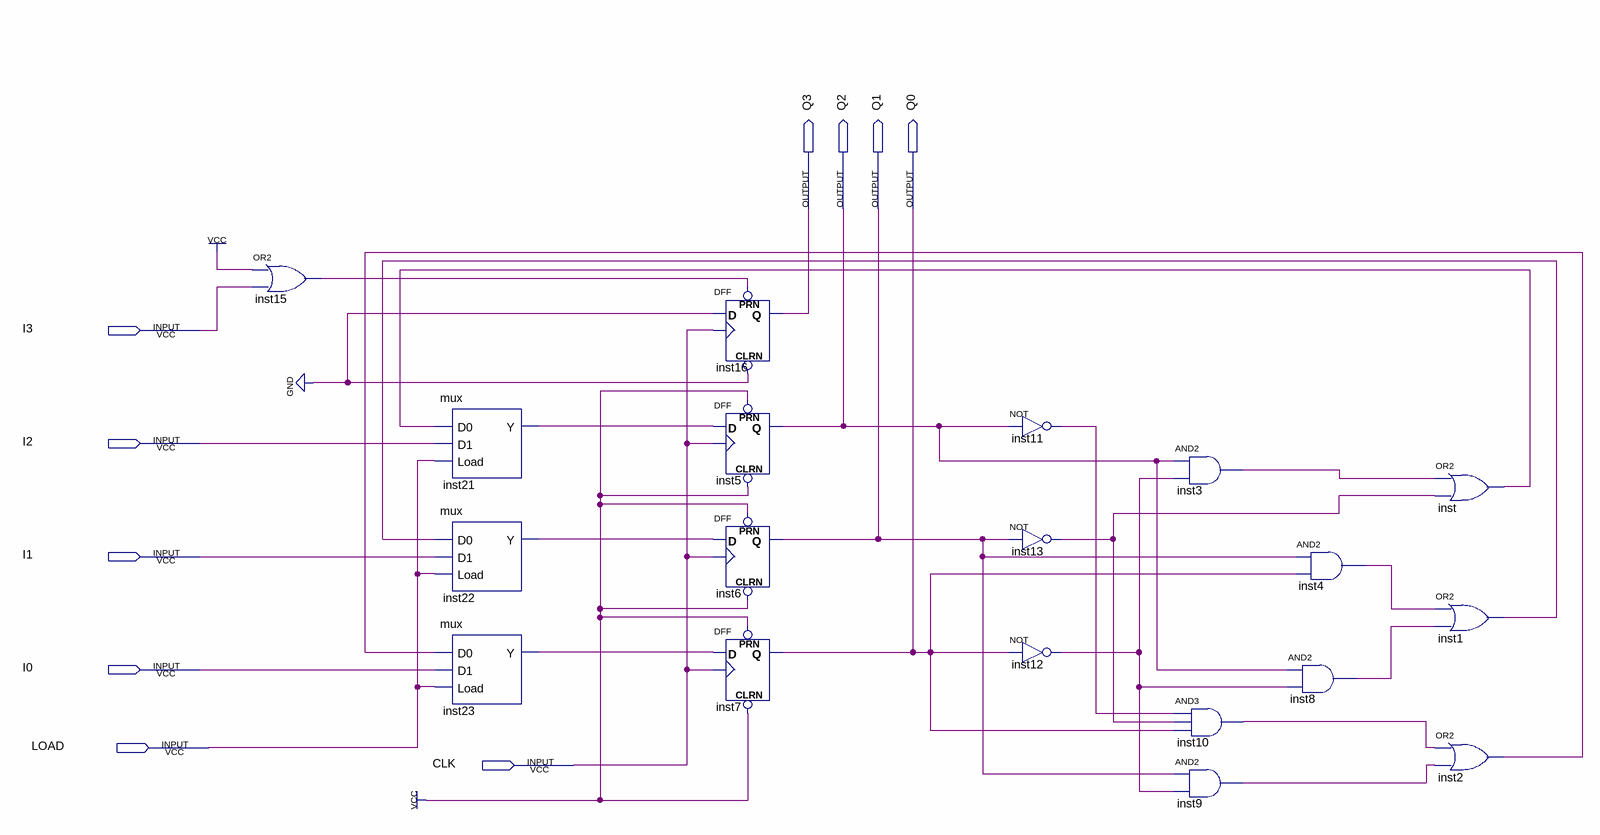
[diagram p0: schematic sheet]
// Quartus schematic LAB1b.bdf as structural Verilog: 19 symbols, 10 pins
module LAB1b (
  input  I3,
  input  I2,
  input  I1,
  input  I0,
  input  LOAD,
  input  CLK,
  output Q3,
  output Q2,
  output Q1,
  output Q0
);

  wire inst1_out, inst2_out, inst3_out, inst4_out, inst8_out, inst9_out, inst10_out, inst11_out, inst12_out,
       inst13_out, inst15_out, inst21_y, inst22_y, inst23_y, inst_out;

  or inst15 (inst15_out, 1'b1, I3);
  mux inst21 (.D0(inst_out), .D1(I2), .Load(LOAD), .Y(inst21_y));
  mux inst22 (.D0(inst1_out), .D1(I1), .Load(LOAD), .Y(inst22_y));
  mux inst23 (.D0(inst2_out), .D1(I0), .Load(LOAD), .Y(inst23_y));
  DFF inst16 (.CLRN(1'b0), .CLK(CLK), .D(1'b0), .PRN(inst15_out), .Q(Q3));
  DFF inst5 (.CLRN(1'b1), .CLK(CLK), .D(inst21_y), .PRN(1'b1), .Q(Q2));
  DFF inst6 (.CLRN(1'b1), .CLK(CLK), .D(inst22_y), .PRN(1'b1), .Q(Q1));
  DFF inst7 (.CLRN(1'b1), .CLK(CLK), .D(inst23_y), .PRN(1'b1), .Q(Q0));
  not inst11 (inst11_out, Q2);
  not inst13 (inst13_out, Q1);
  not inst12 (inst12_out, Q0);
  and inst3 (inst3_out, Q2, inst12_out);
  and inst10 (inst10_out, inst11_out, inst13_out, Q0);
  and inst9 (inst9_out, Q1, inst12_out);
  and inst4 (inst4_out, Q1, Q0);
  and inst8 (inst8_out, Q2, inst12_out);
  or inst (inst_out, inst3_out, inst13_out);
  or inst1 (inst1_out, inst4_out, inst8_out);
  or inst2 (inst2_out, inst10_out, inst9_out);
endmodule
